# Altium project PCB_Project.PrjPcb
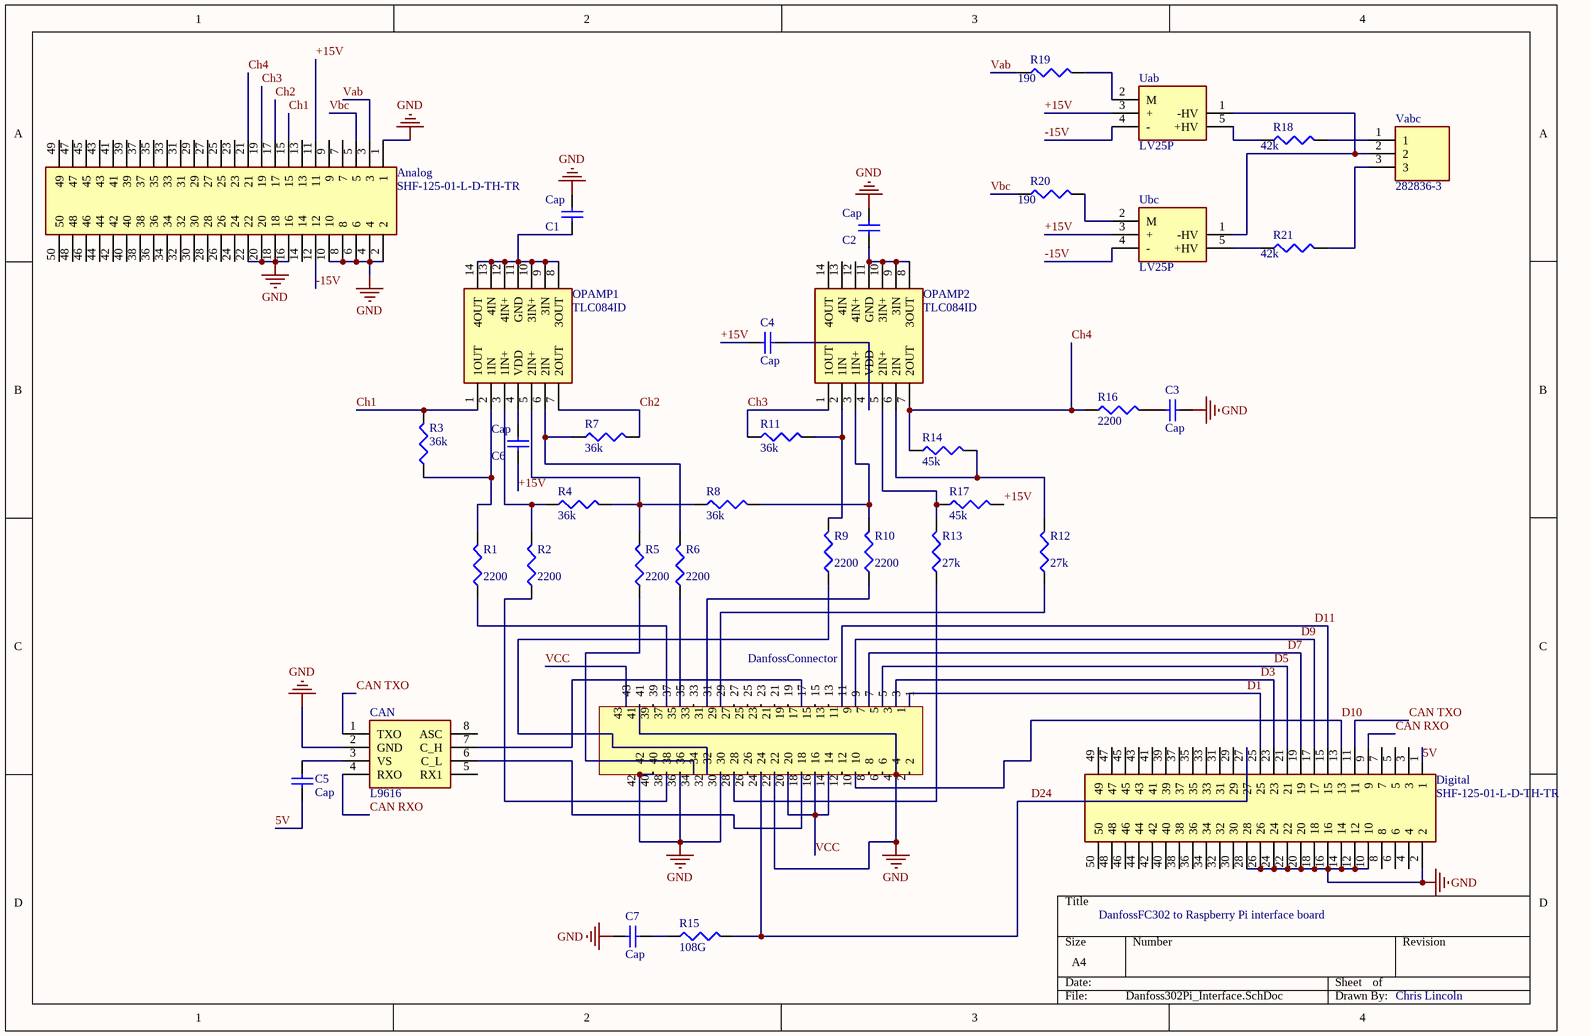
[diagram p0: Danfoss302Pi_Interface.SchDoc]
1 sheet, 37 parts. Net scope: global (net labels, ports and power ports of the same name join across sheets).
Board file: Danfoss302Pi_Interface_complete.PcbDoc

## Sheet Danfoss302Pi_Interface.SchDoc
size A4; SheetNumber: 1; SheetTotal: 1

### Parts
Analog  SHF-125-01-L-D-TH-TR  [SHF12501LDTHTR]
C1  Cap  [C1206]
C2  Cap  [C1206]
C3  Cap  [C1206]
C4  Cap  [C1206]
C5  Cap  [C1206]
C6  Cap  [C1206]
C7  Cap  [C1206]
CAN  L9616  [SOIC127P600X175-8N]
DanfossConeector  DanfossConnector  [DanfossConnector]  (part F of 6)
Digital  SHF-125-01-L-D-TH-TR  [SHF12501LDTHTR]
OPAMP1  TLC084ID  [SOIC127P600X175-14N]
OPAMP2  TLC084ID  [SOIC127P600X175-14N]
R1  value 2200  [J1-0603]  (hidden comment: Res3)
R2  value 2200  [J1-0603]  (hidden comment: Res3)
R3  value 36k  [J1-0603]  (hidden comment: Res3)
R4  value 36k  [J1-0603]  (hidden comment: Res3)
R5  value 2200  [J1-0603]  (hidden comment: Res3)
R6  value 2200  [J1-0603]  (hidden comment: Res3)
R7  value 36k  [J1-0603]  (hidden comment: Res3)
R8  value 36k  [J1-0603]  (hidden comment: Res3)
R9  value 2200  [J1-0603]  (hidden comment: Res3)
R10  value 2200  [J1-0603]  (hidden comment: Res3)
R11  value 36k  [J1-0603]  (hidden comment: Res3)
R12  value 27k  [J1-0603]  (hidden comment: Res3)
R13  value 27k  [J1-0603]  (hidden comment: Res3)
R14  value 45k  [J1-0603]  (hidden comment: Res3)
R15  value 108G  [J1-0603]  (hidden comment: Res3)
R16  value 2200  [J1-0603]  (hidden comment: Res3)
R17  value 45k  [J1-0603]  (hidden comment: Res3)
R18  value 42k  [J1-0603]  (hidden comment: Res3)
R19  value 190  [J1-0603]  (hidden comment: Res3)
R20  value 190  [J1-0603]  (hidden comment: Res3)
R21  value 42k  [J1-0603]  (hidden comment: Res3)
Uab  LV25P  [LV-25-P]
Ubc  LV25P  [LV-25-P]
Vabc  282836-3  [2828363]

### Nets
GND: Analog.1 Analog.2 Analog.4 Analog.6 Analog.8 Analog.10 Analog.16 Analog.18 Analog.20 Analog.22 C1.2 C2.2 C3.2 C7.1 CAN.2(GND) DanfossConeector.4 DanfossConeector.22 DanfossConeector.30 DanfossConeector.36 DanfossConeector.40 DanfossConeector.41 DanfossConeector.42 Digital.2 Digital.10 Digital.12 Digital.14 Digital.16 Digital.18 Digital.20 Digital.22 Digital.24 Digital.26 Digital.28
5V: C5.1 Digital.1
+15V: Analog.11 C4.1 C6.1 R17.2 Uab.3(+) Ubc.3(+)
-15V: Analog.12 Uab.4(-) Ubc.4(-)
CAN RXO: CAN.4(RXO) Digital.9
CAN TXO: CAN.1(TXO) Digital.11
Ch1: Analog.15 OPAMP1.1(1OUT) R3.2
Ch2: Analog.17 OPAMP1.7(2OUT) R7.2
Ch3: Analog.19 OPAMP2.1(1OUT) R11.1
Ch4: Analog.21 OPAMP2.7(2OUT) R14.1 R16.1
D1: DanfossConeector.1 Digital.25
D3: DanfossConeector.3 Digital.23
D5: DanfossConeector.5 Digital.21
D7: DanfossConeector.7 Digital.19
D9: DanfossConeector.9 Digital.17
D10: DanfossConeector.10 Digital.13
D11: DanfossConeector.11 Digital.15
D24: DanfossConeector.24 Digital.27 R15.2
Vab: Analog.3 R19.1
Vbc: Analog.5 R20.1
VCC: DanfossConeector.14 DanfossConeector.16 DanfossConeector.20 DanfossConeector.43
NetC1_1: C1.1 OPAMP1.8(3OUT) OPAMP1.9(3IN) OPAMP1.10(3IN+) OPAMP1.11(GND) OPAMP1.12(4IN+) OPAMP1.13(4IN) OPAMP1.14(4OUT)
NetC2_1: C2.1 OPAMP2.8(3OUT) OPAMP2.9(3IN) OPAMP2.10(3IN+) OPAMP2.11(GND)
NetC3_1: C3.1 R16.2
NetC4_2: C4.2 OPAMP2.4(VDD)
NetC5_2: C5.2 CAN.3(VS)
NetC6_2: C6.2 OPAMP1.4(VDD)
NetC7_2: C7.2 R15.1
NetCAN_6: CAN.6(C_L) DanfossConeector.18
NetCAN_7: CAN.7(C_H) DanfossConeector.17
NetDanfossConeector_28: DanfossConeector.28 R13.1
NetDanfossConeector_29: DanfossConeector.29 R12.1
NetDanfossConeector_31: DanfossConeector.31 R10.1
NetDanfossConeector_32: DanfossConeector.32 R9.1
NetDanfossConeector_34: DanfossConeector.34 R5.1
NetDanfossConeector_35: DanfossConeector.35 R6.1
NetDanfossConeector_37: DanfossConeector.37 R1.1
NetDanfossConeector_38: DanfossConeector.38 R2.1
NetOPAMP1_2: OPAMP1.2(1IN) R1.2 R3.1
NetOPAMP1_3: OPAMP1.3(1IN+) R2.2 R4.1
NetOPAMP1_5: OPAMP1.5(2IN+) R4.2 R5.2 R8.1
NetOPAMP1_6: OPAMP1.6(2IN) R6.2 R7.1
NetOPAMP2_2: OPAMP2.2(1IN) R9.2 R11.2
NetOPAMP2_3: OPAMP2.3(1IN+) R8.2 R10.2
NetOPAMP2_5: OPAMP2.5(2IN+) R13.2 R17.1
NetOPAMP2_6: OPAMP2.6(2IN) R12.2 R14.2
NetR18_1: R18.1 Uab.5(+HV)
NetR18_2: R18.2 Vabc.1
NetR19_2: R19.2 Uab.2(M)
NetR20_2: R20.2 Ubc.2(M)
NetR21_1: R21.1 Ubc.5(+HV)
NetR21_2: R21.2 Vabc.3
NetUab_1: Uab.1(-HV) Ubc.1(-HV) Vabc.2

Not connected (* = marked no-connect by the designer): Analog 7 9 13 14 23 24 25 26 27 28 29 30 31 32 33 34 35 36 37 38 39 40 41 42 43 44 45 46 47 48 49 50; CAN 5(RX1) 8(ASC); DanfossConeector 2 6 8 12 13 15 19 21 23 25 26 27 33 39; Digital 3 4 5 6 7 8 29 30 31 32 33 34 35 36 37 38 39 40 41 42 43 44 45 46 47 48 49 50; OPAMP2 12(4IN+) 13(4IN) 14(4OUT)

### Notes on the sheet
- DanfossFC302 to Raspberry Pi interface board
- Chris Lincoln

### Library data of the parts
Analog Digital = SHF-125-01-L-D-TH-TR: Connector; Manufacturer_Name: SAMTEC; Datasheet Link: http://suddendocs.samtec.com/catalog_english/shf.pdf; Height: 5.33mm; Manufacturer_Part_Number: SHF-125-01-L-D-TH-TR; Mouser Part Number: 200-SHF12501LDTHTR; Mouser Price/Stock: https://www.mouser.com/Search/Refine.aspx?Keyword=200-SHF12501LDTHTR
C1-C7 = Cap Semi: Capacitor (Semiconductor SIM Model); Value: 100pF; Published: 8-Jun-2000; LatestRevisionDate: 29-May-2009; LatestRevisionNote: IPC-7351 Footprint Added.; PackageReference: C1206; Publisher: Altium Limited; PackageDescription: Chip Capacitor
CAN = L9616: Integrated Circuit; Manufacturer_Name: STMicroelectronics; Datasheet Link: http://www.st.com/st-web-ui/static/active/en/resource/technical/document/datasheet/CD00002241.pdf; Height: 1.75mm; Manufacturer_Part_Number: L9616; Mouser Part Number: 511-L9616; Mouser Price/Stock: https://www.mouser.co.uk/ProductDetail/STMicroelectronics/L9616?qs=Au9%252BK7QVGzVbR%252BTIYyk1Fg%3D%3D; Arrow Part Number: L9616; Arrow Price/Stock: https://www.arrow.com/en/products/l9616/stmicroelectronics?region=nac
OPAMP1 OPAMP2 = TLC084ID: Integrated Circuit; Manufacturer_Name: Texas Instruments; Datasheet Link: http://www.ti.com/lit/gpn/TLC084; Height: 1.75mm; Manufacturer_Part_Number: TLC084ID; Mouser Part Number: 595-TLC084ID; Mouser Price/Stock: https://www.mouser.co.uk/ProductDetail/Texas-Instruments/TLC084ID?qs=AMJt07B76uvL3RFY0L2wYQ%3D%3D; Arrow Part Number: TLC084ID; Arrow Price/Stock: https://www.arrow.com/en/products/tlc084id/texas-instruments
R1-R21 = Res3: Resistor; Published: 8-Jun-2000; LatestRevisionDate: 29-May-2009; LatestRevisionNote: IPC-7351 Footprint Added.; PackageReference: J1-0603; Publisher: Altium Limited; PackageDescription: Chip Resistor
Uab Ubc = LV25P: Undefined or Miscellaneous; Manufacturer_Name: LEM; Manufacturer_Part_Number: LV25P
Vabc = 282836-3: Connector; Manufacturer_Name: TE Connectivity; Datasheet Link: https://www.te.com/commerce/DocumentDelivery/DDEController?Action=showdoc&DocId=Customer+Drawing%7F282836%7FJ%7Fpdf%7FEnglish%7FENG_CD_282836_J.pdf%7F282836-3; Height: 10mm; Manufacturer_Part_Number: 282836-3; Mouser Part Number: 571-2828363; Mouser Price/Stock: https://www.mouser.co.uk/ProductDetail/TE-Connectivity/282836-3?qs=A%252Bip%252BNCYi6PbXzB92YbbqQ%3D%3D; Arrow Part Number: 282836-3; Arrow Price/Stock: https://www.arrow.com/en/products/282836-3/te-connectivity?region=nac